# Altium schematic sheet RF_TOP_LEVEL.SchDoc
size A4; DocumentNumber: 45; SheetNumber: 45; SheetTotal: 47
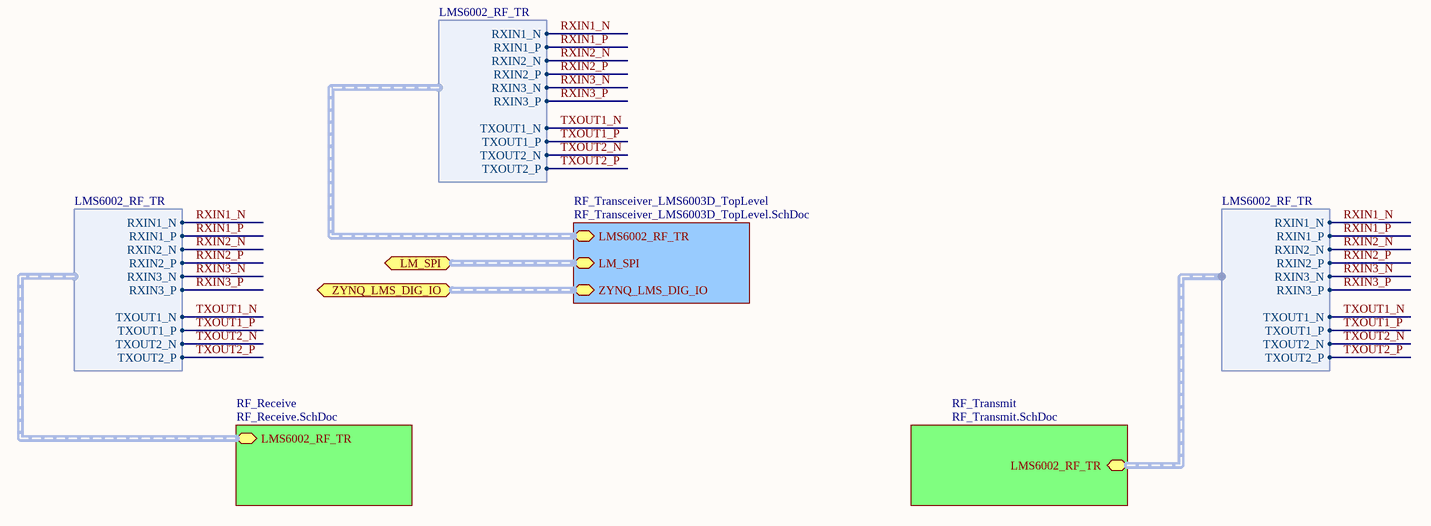
[diagram p0: RF_TOP_LEVEL.SchDoc]

## Sub-sheets
RF_Receive = RF_Receive.SchDoc: LMS6002_RF_TR (harness LMS6002_RF_TR)
RF_Transceiver_LMS6003D_TopLevel = RF_Transceiver_LMS6003D_TopLevel.SchDoc: LMS6002_RF_TR (harness LMS6002_RF_TR), LM_SPI (harness LM_SPI), ZYNQ_LMS_DIG_IO (harness DIG_IO)
RF_Transmit = RF_Transmit.SchDoc: LMS6002_RF_TR (harness LMS6002_RF_TR)

## Ports
LM_SPI (harness LM_SPI), ZYNQ_LMS_DIG_IO (harness DIG_IO)

## Harnesses
LMS6002_RF_TR: RXIN1_N, RXIN1_P, RXIN2_N, RXIN2_P, RXIN3_N, RXIN3_P, TXOUT1_N, TXOUT1_P, TXOUT2_N, TXOUT2_P

## Nets
RXIN1_N: sheet RF_Transceiver_LMS6003D_TopLevel/LMS6002_RF_TR.RXIN1_N, sheet RF_Receive/LMS6002_RF_TR.RXIN1_N, sheet RF_Transmit/LMS6002_RF_TR.RXIN1_N
RXIN1_P: sheet RF_Transceiver_LMS6003D_TopLevel/LMS6002_RF_TR.RXIN1_P, sheet RF_Receive/LMS6002_RF_TR.RXIN1_P, sheet RF_Transmit/LMS6002_RF_TR.RXIN1_P
RXIN2_N: sheet RF_Transceiver_LMS6003D_TopLevel/LMS6002_RF_TR.RXIN2_N, sheet RF_Receive/LMS6002_RF_TR.RXIN2_N, sheet RF_Transmit/LMS6002_RF_TR.RXIN2_N
RXIN2_P: sheet RF_Transceiver_LMS6003D_TopLevel/LMS6002_RF_TR.RXIN2_P, sheet RF_Receive/LMS6002_RF_TR.RXIN2_P, sheet RF_Transmit/LMS6002_RF_TR.RXIN2_P
RXIN3_N: sheet RF_Transceiver_LMS6003D_TopLevel/LMS6002_RF_TR.RXIN3_N, sheet RF_Receive/LMS6002_RF_TR.RXIN3_N, sheet RF_Transmit/LMS6002_RF_TR.RXIN3_N
RXIN3_P: sheet RF_Transceiver_LMS6003D_TopLevel/LMS6002_RF_TR.RXIN3_P, sheet RF_Receive/LMS6002_RF_TR.RXIN3_P, sheet RF_Transmit/LMS6002_RF_TR.RXIN3_P
TXOUT1_N: sheet RF_Transceiver_LMS6003D_TopLevel/LMS6002_RF_TR.TXOUT1_N, sheet RF_Receive/LMS6002_RF_TR.TXOUT1_N, sheet RF_Transmit/LMS6002_RF_TR.TXOUT1_N
TXOUT1_P: sheet RF_Transceiver_LMS6003D_TopLevel/LMS6002_RF_TR.TXOUT1_P, sheet RF_Receive/LMS6002_RF_TR.TXOUT1_P, sheet RF_Transmit/LMS6002_RF_TR.TXOUT1_P
TXOUT2_N: sheet RF_Transceiver_LMS6003D_TopLevel/LMS6002_RF_TR.TXOUT2_N, sheet RF_Receive/LMS6002_RF_TR.TXOUT2_N, sheet RF_Transmit/LMS6002_RF_TR.TXOUT2_N
TXOUT2_P: sheet RF_Transceiver_LMS6003D_TopLevel/LMS6002_RF_TR.TXOUT2_P, sheet RF_Receive/LMS6002_RF_TR.TXOUT2_P, sheet RF_Transmit/LMS6002_RF_TR.TXOUT2_P

## Buses and harness runs
harness port LM_SPI = sheet RF_Transceiver_LMS6003D_TopLevel/LM_SPI
harness port ZYNQ_LMS_DIG_IO = sheet RF_Transceiver_LMS6003D_TopLevel/ZYNQ_LMS_DIG_IO